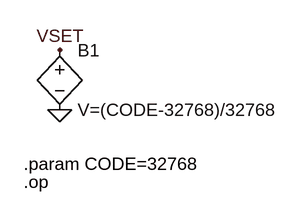
[diagram p0: schematic Draft2.asc]
Draft2.asc, the LTspice schematic file:
Version 4.1
SHEET 1 880 680
FLAG 160 128 VSET
FLAG 160 208 0
SYMBOL bv 160 112 R0
SYMATTR InstName B1
SYMATTR Value V=(CODE-32768)/32768
TEXT 112 280 Left 2 !.param CODE=32768
TEXT 112 304 Left 2 !.op

The netlist it stands for:
* Draft2.asc
B1 VSET 0 V=(CODE-32768)/32768
.param CODE=32768
.op
.backanno
.end